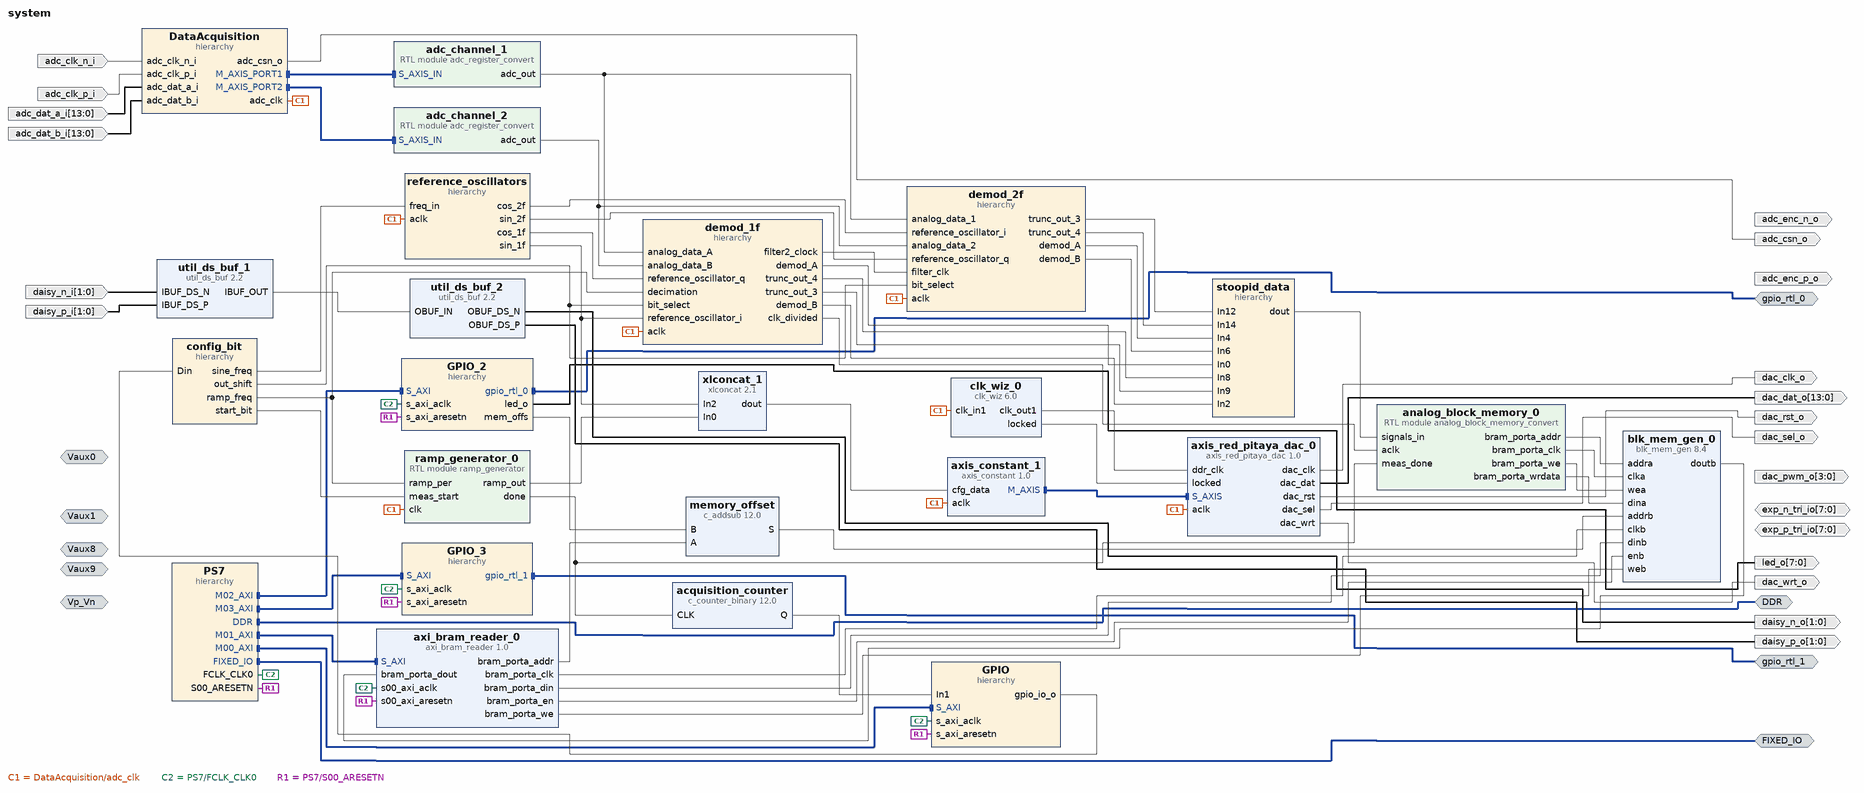
[diagram p0: block diagram of the top level]
# Vivado block design system, xc7z010clg400-1, Vivado 2022.2
create_bd_design system

create_bd_intf_port -mode Slave -vlnv xilinx.com:interface:diff_analog_io_rtl:1.0 Vp_Vn
create_bd_intf_port -mode Slave -vlnv xilinx.com:interface:diff_analog_io_rtl:1.0 Vaux0
create_bd_intf_port -mode Slave -vlnv xilinx.com:interface:diff_analog_io_rtl:1.0 Vaux1
create_bd_intf_port -mode Slave -vlnv xilinx.com:interface:diff_analog_io_rtl:1.0 Vaux9
create_bd_intf_port -mode Slave -vlnv xilinx.com:interface:diff_analog_io_rtl:1.0 Vaux8
create_bd_intf_port -mode Master -vlnv xilinx.com:interface:ddrx_rtl:1.0 DDR
create_bd_intf_port -mode Master -vlnv xilinx.com:display_processing_system7:fixedio_rtl:1.0 FIXED_IO
create_bd_intf_port -mode Master -vlnv xilinx.com:interface:gpio_rtl:1.0 gpio_rtl_0
create_bd_intf_port -mode Master -vlnv xilinx.com:interface:gpio_rtl:1.0 gpio_rtl_1
create_bd_port -dir I -from 13 -to 0 adc_dat_a_i
create_bd_port -dir I -from 13 -to 0 adc_dat_b_i
create_bd_port -dir I adc_clk_p_i
create_bd_port -dir I adc_clk_n_i
create_bd_port -dir O adc_enc_p_o
create_bd_port -dir O adc_enc_n_o
create_bd_port -dir O adc_csn_o
create_bd_port -dir O -from 13 -to 0 dac_dat_o
create_bd_port -dir O dac_clk_o
create_bd_port -dir O dac_rst_o
create_bd_port -dir O dac_sel_o
create_bd_port -dir O dac_wrt_o
create_bd_port -dir O -from 3 -to 0 dac_pwm_o
create_bd_port -dir IO -from 7 -to 0 exp_p_tri_io
create_bd_port -dir IO -from 7 -to 0 exp_n_tri_io
create_bd_port -dir O -from 1 -to 0 daisy_p_o
create_bd_port -dir O -from 1 -to 0 daisy_n_o
create_bd_port -dir I -from 1 -to 0 daisy_p_i
create_bd_port -dir I -from 1 -to 0 daisy_n_i
create_bd_port -dir O -from 7 -to 0 led_o

create_bd_cell -type ip -vlnv xilinx.com:ip:util_ds_buf:2.2 util_ds_buf_1
set_property -dict {CONFIG.C_SIZE 2} [get_bd_cells util_ds_buf_1]
create_bd_cell -type ip -vlnv xilinx.com:ip:util_ds_buf:2.2 util_ds_buf_2
set_property -dict {CONFIG.C_BUF_TYPE OBUFDS CONFIG.C_SIZE 2} [get_bd_cells util_ds_buf_2]
create_bd_cell -type hier GPIO
create_bd_cell -type hier PS7
create_bd_cell -type hier DataAcquisition
create_bd_cell -type ip -vlnv xilinx.com:ip:clk_wiz:6.0 clk_wiz_0
set_property -dict [list \
  CONFIG.CLKIN1_JITTER_PS 80.0 \
  CONFIG.CLKOUT1_JITTER 104.759 \
  CONFIG.CLKOUT1_PHASE_ERROR 96.948 \
  CONFIG.CLKOUT1_REQUESTED_OUT_FREQ 250.000 \
  CONFIG.MMCM_CLKFBOUT_MULT_F 8.000 \
  CONFIG.MMCM_CLKIN1_PERIOD 8.000 \
  CONFIG.MMCM_CLKOUT0_DIVIDE_F 4.000 \
  CONFIG.MMCM_DIVCLK_DIVIDE 1 \
  CONFIG.PRIM_IN_FREQ 125.000 \
  CONFIG.USE_RESET false \
] [get_bd_cells clk_wiz_0]
create_bd_cell -type ip -vlnv pavel-demin:user:axis_red_pitaya_dac:1.0 axis_red_pitaya_dac_0
create_bd_cell -type hier config_bit
create_bd_cell -type ip -vlnv xilinx.com:ip:xlconcat:2.1 xlconcat_1
set_property -dict [list \
  CONFIG.IN0_WIDTH 14 \
  CONFIG.IN1_WIDTH 2 \
  CONFIG.IN2_WIDTH 14 \
  CONFIG.IN3_WIDTH 2 \
  CONFIG.NUM_PORTS 4 \
] [get_bd_cells xlconcat_1]
create_bd_cell -type ip -vlnv pavel-demin:user:axis_constant:1.0 axis_constant_1
create_bd_cell -type ip -vlnv xilinx.com:ip:c_counter_binary:12.0 acquisition_counter
create_bd_cell -type ip -vlnv anton-potocnik:user:axi_bram_reader:1.0 axi_bram_reader_0
set_property -dict {CONFIG.BRAM_ADDR_WIDTH 13} [get_bd_cells axi_bram_reader_0]
create_bd_cell -type ip -vlnv xilinx.com:ip:blk_mem_gen:8.4 blk_mem_gen_0
set_property -dict [list \
  CONFIG.Enable_32bit_Address false \
  CONFIG.Enable_A Always_Enabled \
  CONFIG.Enable_B Use_ENB_Pin \
  CONFIG.Memory_Type True_Dual_Port_RAM \
  CONFIG.Operating_Mode_B READ_FIRST \
  CONFIG.Port_B_Clock 100 \
  CONFIG.Port_B_Enable_Rate 100 \
  CONFIG.Port_B_Write_Rate 50 \
  CONFIG.Read_Width_A 128 \
  CONFIG.Read_Width_B 32 \
  CONFIG.Register_PortA_Output_of_Memory_Primitives false \
  CONFIG.Register_PortB_Output_of_Memory_Primitives false \
  CONFIG.Use_Byte_Write_Enable false \
  CONFIG.Use_RSTA_Pin false \
  CONFIG.Use_RSTB_Pin false \
  CONFIG.Write_Depth_A 16383 \
  CONFIG.Write_Width_A 128 \
  CONFIG.Write_Width_B 32 \
  CONFIG.use_bram_block Stand_Alone \
] [get_bd_cells blk_mem_gen_0]
create_bd_cell -type hier stoopid_data
create_bd_cell -type hier GPIO_2
create_bd_cell -type ip -vlnv xilinx.com:ip:c_addsub:12.0 memory_offset
set_property -dict [list \
  CONFIG.A_Type Signed \
  CONFIG.A_Width 13 \
  CONFIG.B_Constant false \
  CONFIG.B_Type Signed \
  CONFIG.B_Value 0000000000000000 \
  CONFIG.B_Width 16 \
  CONFIG.CE false \
  CONFIG.Implementation Fabric \
  CONFIG.Latency 0 \
  CONFIG.Latency_Configuration Manual \
  CONFIG.Out_Width 16 \
] [get_bd_cells memory_offset]
create_bd_cell -type module -reference analog_block_memory_convert analog_block_memory_0
create_bd_cell -type hier GPIO_3
create_bd_cell -type hier demod_1f
create_bd_cell -type module -reference adc_register_convert adc_channel_1
create_bd_cell -type module -reference adc_register_convert adc_channel_2
create_bd_cell -type hier reference_oscillators
create_bd_cell -type hier demod_2f
create_bd_cell -type module -reference ramp_generator ramp_generator_0

# ---- hierarchy /GPIO ----
current_bd_instance /GPIO
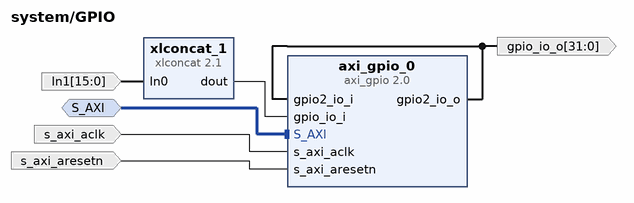
[diagram p1: block diagram inside /GPIO]
create_bd_intf_pin -mode Slave -vlnv xilinx.com:interface:aximm_rtl:1.0 S_AXI
create_bd_pin -dir I -type clk s_axi_aclk
create_bd_pin -dir I -type rst s_axi_aresetn
create_bd_pin -dir O -from 31 -to 0 gpio_io_o
create_bd_pin -dir I -from 15 -to 0 In1

create_bd_cell -type ip -vlnv xilinx.com:ip:xlconcat:2.1 xlconcat_1
set_property -dict {CONFIG.IN0_WIDTH 16 CONFIG.IN1_WIDTH 16} [get_bd_cells xlconcat_1]
create_bd_cell -type ip -vlnv xilinx.com:ip:axi_gpio:2.0 axi_gpio_0
set_property -dict {CONFIG.C_ALL_INPUTS 1 CONFIG.C_ALL_INPUTS_2 0 CONFIG.C_IS_DUAL 1} [get_bd_cells axi_gpio_0]

# ---- hierarchy /PS7 ----
current_bd_instance /PS7
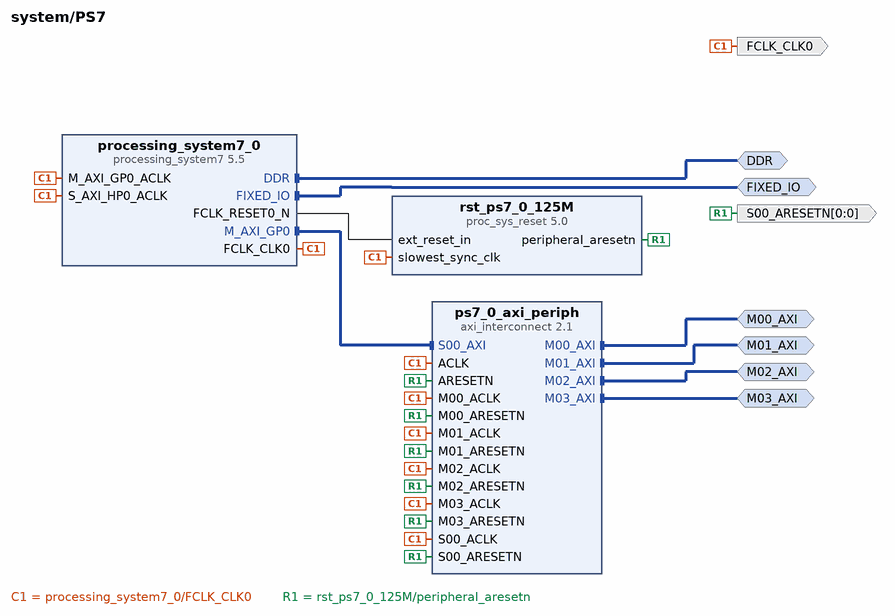
[diagram p2: block diagram inside /PS7]
create_bd_intf_pin -mode Master -vlnv xilinx.com:interface:ddrx_rtl:1.0 DDR
create_bd_intf_pin -mode Master -vlnv xilinx.com:display_processing_system7:fixedio_rtl:1.0 FIXED_IO
create_bd_intf_pin -mode Master -vlnv xilinx.com:interface:aximm_rtl:1.0 M00_AXI
create_bd_intf_pin -mode Master -vlnv xilinx.com:interface:aximm_rtl:1.0 M01_AXI
create_bd_intf_pin -mode Master -vlnv xilinx.com:interface:aximm_rtl:1.0 M02_AXI
create_bd_intf_pin -mode Master -vlnv xilinx.com:interface:aximm_rtl:1.0 M03_AXI
create_bd_pin -dir O -type clk FCLK_CLK0
create_bd_pin -dir O -from 0 -to 0 -type rst S00_ARESETN

create_bd_cell -type ip -vlnv xilinx.com:ip:processing_system7:5.5 processing_system7_0
set_property -dict [list \
  CONFIG.PCW_APU_PERIPHERAL_FREQMHZ 666.666666 \
  CONFIG.PCW_ENET0_ENET0_IO {MIO 16 .. 27} \
  CONFIG.PCW_ENET0_GRP_MDIO_ENABLE 1 \
  CONFIG.PCW_ENET0_GRP_MDIO_IO EMIO \
  CONFIG.PCW_ENET0_PERIPHERAL_ENABLE 1 \
  CONFIG.PCW_ENET0_RESET_ENABLE 0 \
  CONFIG.PCW_ENET_RESET_ENABLE 1 \
  CONFIG.PCW_ENET_RESET_SELECT {Share reset pin} \
  CONFIG.PCW_FPGA0_PERIPHERAL_FREQMHZ 125 \
  CONFIG.PCW_FPGA1_PERIPHERAL_FREQMHZ 250 \
  CONFIG.PCW_FPGA3_PERIPHERAL_FREQMHZ 200 \
  CONFIG.PCW_GPIO_MIO_GPIO_ENABLE 1 \
  CONFIG.PCW_GPIO_MIO_GPIO_IO MIO \
  CONFIG.PCW_GPIO_PERIPHERAL_ENABLE 1 \
  CONFIG.PCW_I2C0_GRP_INT_ENABLE 0 \
  CONFIG.PCW_I2C0_I2C0_IO {MIO 50 .. 51} \
  CONFIG.PCW_I2C0_PERIPHERAL_ENABLE 1 \
  CONFIG.PCW_I2C_PERIPHERAL_FREQMHZ 111.111115 \
  CONFIG.PCW_I2C_RESET_ENABLE 1 \
  CONFIG.PCW_I2C_RESET_SELECT {Share reset pin} \
  CONFIG.PCW_IMPORT_BOARD_PRESET cfg/red_pitaya.xml \
  CONFIG.PCW_PRESET_BANK1_VOLTAGE {LVCMOS 2.5V} \
  CONFIG.PCW_QSPI_GRP_SINGLE_SS_ENABLE 1 \
  CONFIG.PCW_QSPI_GRP_SINGLE_SS_IO {MIO 1 .. 6} \
  CONFIG.PCW_QSPI_PERIPHERAL_ENABLE 1 \
  CONFIG.PCW_QSPI_PERIPHERAL_FREQMHZ 125 \
  CONFIG.PCW_QSPI_QSPI_IO {MIO 1 .. 6} \
  CONFIG.PCW_SD0_GRP_CD_ENABLE 1 \
  CONFIG.PCW_SD0_GRP_CD_IO {MIO 46} \
  CONFIG.PCW_SD0_GRP_WP_ENABLE 1 \
  CONFIG.PCW_SD0_GRP_WP_IO {MIO 47} \
  CONFIG.PCW_SD0_PERIPHERAL_ENABLE 1 \
  CONFIG.PCW_SD0_SD0_IO {MIO 40 .. 45} \
  CONFIG.PCW_SDIO_PERIPHERAL_FREQMHZ 100 \
  CONFIG.PCW_SINGLE_QSPI_DATA_MODE x4 \
  CONFIG.PCW_SPI0_PERIPHERAL_ENABLE 1 \
  CONFIG.PCW_SPI0_SPI0_IO EMIO \
  CONFIG.PCW_SPI1_PERIPHERAL_ENABLE 1 \
  CONFIG.PCW_SPI1_SPI1_IO {MIO 10 .. 15} \
  CONFIG.PCW_TTC0_PERIPHERAL_ENABLE 1 \
  CONFIG.PCW_TTC0_TTC0_IO EMIO \
  CONFIG.PCW_UART0_PERIPHERAL_ENABLE 1 \
  CONFIG.PCW_UART0_UART0_IO {MIO 14 .. 15} \
  CONFIG.PCW_UART1_PERIPHERAL_ENABLE 1 \
  CONFIG.PCW_UART1_UART1_IO {MIO 8 .. 9} \
  CONFIG.PCW_UART_PERIPHERAL_FREQMHZ 100 \
  CONFIG.PCW_UIPARAM_DDR_BUS_WIDTH {16 Bit} \
  CONFIG.PCW_UIPARAM_DDR_FREQ_MHZ 533.333333 \
  CONFIG.PCW_UIPARAM_DDR_PARTNO {MT41J256M16 RE-125} \
  CONFIG.PCW_USB0_PERIPHERAL_ENABLE 1 \
  CONFIG.PCW_USB0_RESET_ENABLE 1 \
  CONFIG.PCW_USB0_RESET_IO {MIO 48} \
  CONFIG.PCW_USB0_USB0_IO {MIO 28 .. 39} \
  CONFIG.PCW_USB_RESET_ENABLE 1 \
  CONFIG.PCW_USB_RESET_SELECT {Share reset pin} \
  CONFIG.PCW_USE_S_AXI_HP0 1 \
] [get_bd_cells processing_system7_0]
# 429 more settings of processing_system7_0 are not shown: defaults, MIO pin electricals, DDR timing, and values the tool derives
create_bd_cell -type ip -vlnv xilinx.com:ip:proc_sys_reset:5.0 rst_ps7_0_125M
create_bd_cell -type ip -vlnv xilinx.com:ip:axi_interconnect:2.1 ps7_0_axi_periph
set_property -dict {CONFIG.NUM_MI 4} [get_bd_cells ps7_0_axi_periph]

# ---- hierarchy /DataAcquisition ----
current_bd_instance /DataAcquisition
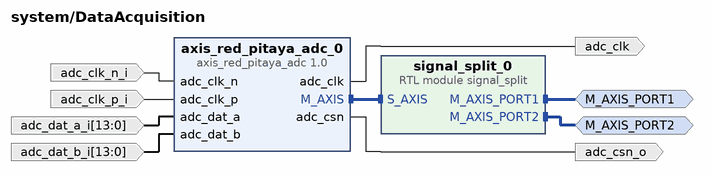
[diagram p3: block diagram inside /DataAcquisition]
create_bd_intf_pin -mode Master -vlnv xilinx.com:interface:axis_rtl:1.0 M_AXIS_PORT1
create_bd_intf_pin -mode Master -vlnv xilinx.com:interface:axis_rtl:1.0 M_AXIS_PORT2
create_bd_pin -dir O -type clk adc_clk
create_bd_pin -dir O adc_csn_o
create_bd_pin -dir I adc_clk_p_i
create_bd_pin -dir I adc_clk_n_i
create_bd_pin -dir I -from 13 -to 0 adc_dat_a_i
create_bd_pin -dir I -from 13 -to 0 adc_dat_b_i

create_bd_cell -type ip -vlnv pavel-demin:user:axis_red_pitaya_adc:1.0 axis_red_pitaya_adc_0
create_bd_cell -type module -reference signal_split signal_split_0

# ---- hierarchy /config_bit ----
current_bd_instance /config_bit
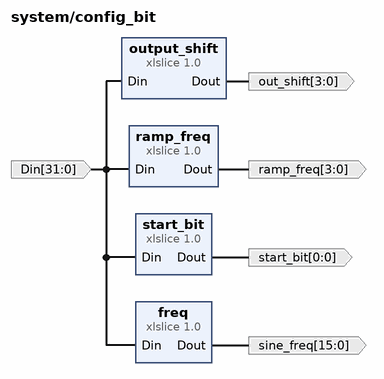
[diagram p4: block diagram inside /config_bit]
create_bd_pin -dir I -from 31 -to 0 Din
create_bd_pin -dir O -from 15 -to 0 sine_freq
create_bd_pin -dir O -from 3 -to 0 ramp_freq
create_bd_pin -dir O -from 0 -to 0 start_bit
create_bd_pin -dir O -from 3 -to 0 out_shift

create_bd_cell -type ip -vlnv xilinx.com:ip:xlslice:1.0 freq
set_property -dict {CONFIG.DIN_FROM 15} [get_bd_cells freq]
create_bd_cell -type ip -vlnv xilinx.com:ip:xlslice:1.0 ramp_freq
set_property -dict {CONFIG.DIN_FROM 19 CONFIG.DIN_TO 16} [get_bd_cells ramp_freq]
create_bd_cell -type ip -vlnv xilinx.com:ip:xlslice:1.0 start_bit
set_property -dict {CONFIG.DIN_FROM 31 CONFIG.DIN_TO 31} [get_bd_cells start_bit]
create_bd_cell -type ip -vlnv xilinx.com:ip:xlslice:1.0 output_shift
set_property -dict {CONFIG.DIN_FROM 23 CONFIG.DIN_TO 20} [get_bd_cells output_shift]

# ---- hierarchy /stoopid_data ----
current_bd_instance /stoopid_data
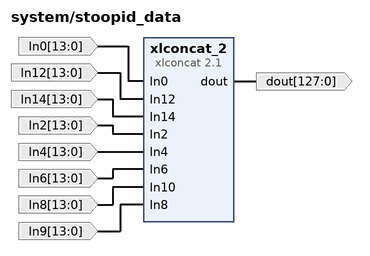
[diagram p5: block diagram inside /stoopid_data]
create_bd_pin -dir O -from 127 -to 0 dout
create_bd_pin -dir I -from 13 -to 0 In0
create_bd_pin -dir I -from 13 -to 0 In2
create_bd_pin -dir I -from 13 -to 0 In4
create_bd_pin -dir I -from 13 -to 0 In6
create_bd_pin -dir I -from 13 -to 0 In8
create_bd_pin -dir I -from 13 -to 0 In14
create_bd_pin -dir I -from 13 -to 0 In9
create_bd_pin -dir I -from 13 -to 0 In12

create_bd_cell -type ip -vlnv xilinx.com:ip:xlconcat:2.1 xlconcat_2
set_property -dict [list \
  CONFIG.IN0_WIDTH 14 \
  CONFIG.IN10_WIDTH 14 \
  CONFIG.IN11_WIDTH 2 \
  CONFIG.IN12_WIDTH 14 \
  CONFIG.IN13_WIDTH 2 \
  CONFIG.IN14_WIDTH 14 \
  CONFIG.IN15_WIDTH 2 \
  CONFIG.IN1_WIDTH 2 \
  CONFIG.IN2_WIDTH 14 \
  CONFIG.IN3_WIDTH 2 \
  CONFIG.IN4_WIDTH 14 \
  CONFIG.IN5_WIDTH 2 \
  CONFIG.IN6_WIDTH 14 \
  CONFIG.IN7_WIDTH 2 \
  CONFIG.IN8_WIDTH 14 \
  CONFIG.IN9_WIDTH 2 \
  CONFIG.NUM_PORTS 16 \
] [get_bd_cells xlconcat_2]

# ---- hierarchy /GPIO_2 ----
current_bd_instance /GPIO_2
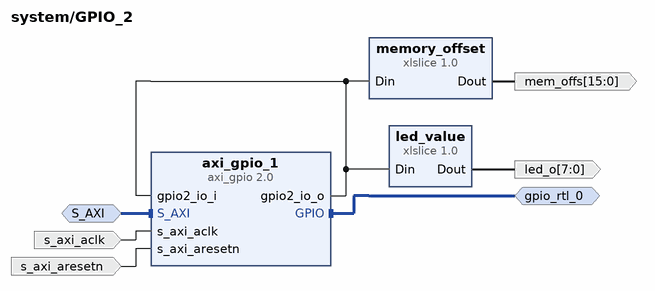
[diagram p6: block diagram inside /GPIO_2]
create_bd_intf_pin -mode Slave -vlnv xilinx.com:interface:aximm_rtl:1.0 S_AXI
create_bd_intf_pin -mode Master -vlnv xilinx.com:interface:gpio_rtl:1.0 gpio_rtl_0
create_bd_pin -dir I -type clk s_axi_aclk
create_bd_pin -dir I -type rst s_axi_aresetn
create_bd_pin -dir O -from 7 -to 0 led_o
create_bd_pin -dir O -from 15 -to 0 mem_offs

create_bd_cell -type ip -vlnv xilinx.com:ip:xlslice:1.0 led_value
set_property -dict {CONFIG.DIN_FROM 7} [get_bd_cells led_value]
create_bd_cell -type ip -vlnv xilinx.com:ip:axi_gpio:2.0 axi_gpio_1
set_property -dict {CONFIG.C_ALL_INPUTS 1 CONFIG.C_ALL_INPUTS_2 0 CONFIG.C_IS_DUAL 1} [get_bd_cells axi_gpio_1]
create_bd_cell -type ip -vlnv xilinx.com:ip:xlslice:1.0 memory_offset
set_property -dict {CONFIG.DIN_FROM 23 CONFIG.DIN_TO 8} [get_bd_cells memory_offset]

# ---- hierarchy /GPIO_3 ----
current_bd_instance /GPIO_3
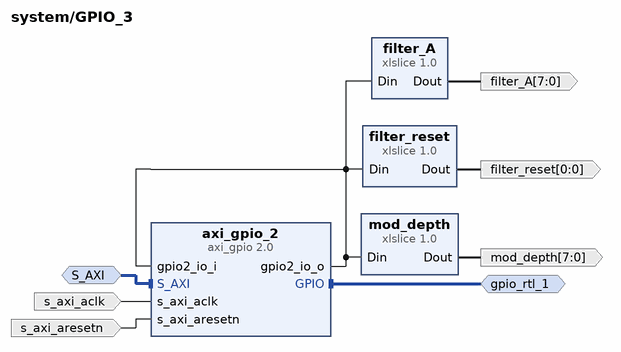
[diagram p7: block diagram inside /GPIO_3]
create_bd_intf_pin -mode Slave -vlnv xilinx.com:interface:aximm_rtl:1.0 S_AXI
create_bd_intf_pin -mode Master -vlnv xilinx.com:interface:gpio_rtl:1.0 gpio_rtl_1
create_bd_pin -dir I -type clk s_axi_aclk
create_bd_pin -dir I -type rst s_axi_aresetn
create_bd_pin -dir O -from 7 -to 0 filter_A
create_bd_pin -dir O -from 7 -to 0 mod_depth
create_bd_pin -dir O -from 0 -to 0 filter_reset

create_bd_cell -type ip -vlnv xilinx.com:ip:xlslice:1.0 filter_A
set_property -dict {CONFIG.DIN_FROM 15 CONFIG.DIN_TO 8} [get_bd_cells filter_A]
create_bd_cell -type ip -vlnv xilinx.com:ip:xlslice:1.0 mod_depth
set_property -dict {CONFIG.DIN_FROM 7} [get_bd_cells mod_depth]
create_bd_cell -type ip -vlnv xilinx.com:ip:axi_gpio:2.0 axi_gpio_2
set_property -dict {CONFIG.C_ALL_INPUTS 1 CONFIG.C_ALL_INPUTS_2 0 CONFIG.C_IS_DUAL 1} [get_bd_cells axi_gpio_2]
create_bd_cell -type ip -vlnv xilinx.com:ip:xlslice:1.0 filter_reset
set_property -dict {CONFIG.DIN_FROM 16 CONFIG.DIN_TO 16} [get_bd_cells filter_reset]

# ---- hierarchy /demod_1f ----
current_bd_instance /demod_1f
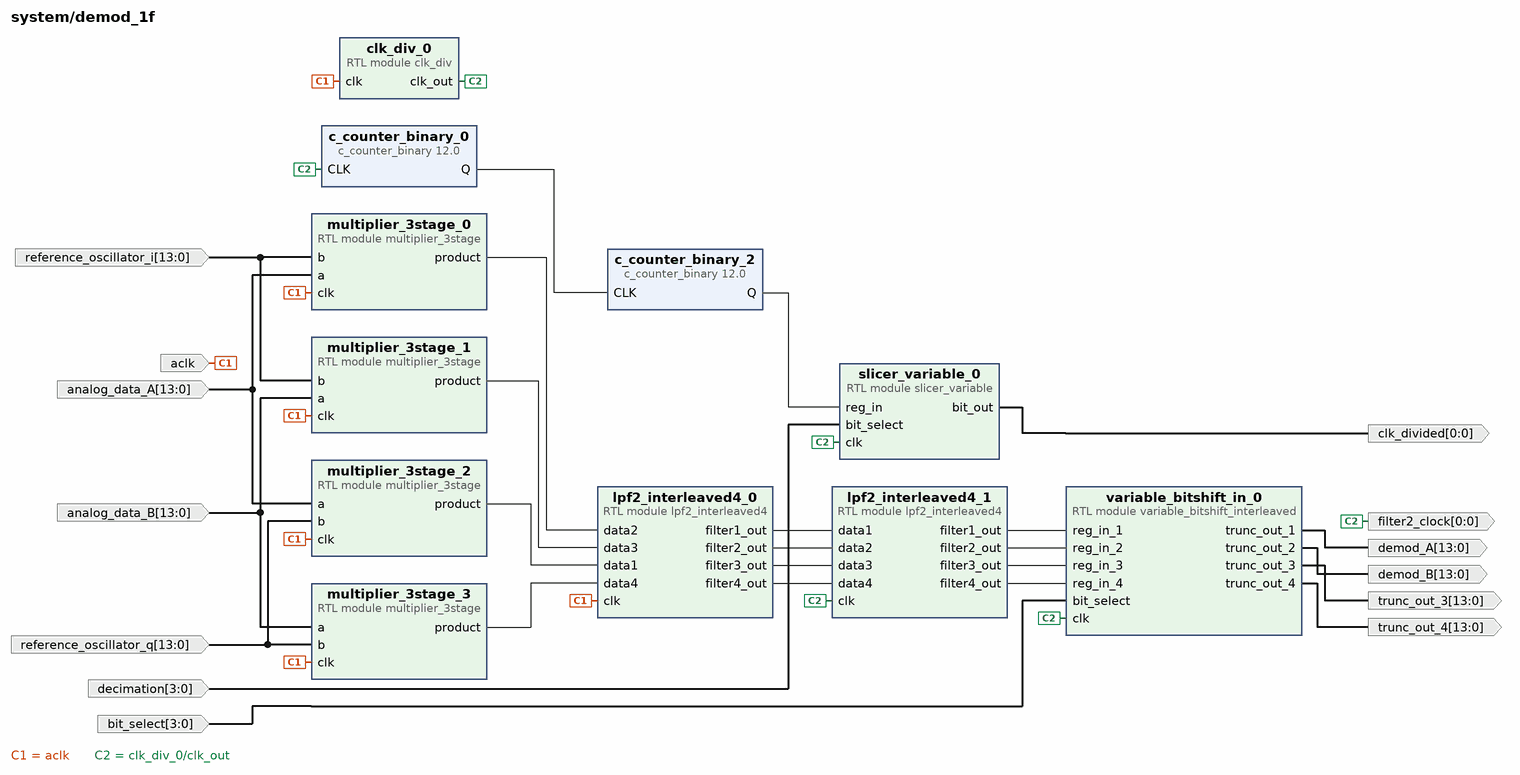
[diagram p8: block diagram inside /demod_1f]
create_bd_pin -dir I -type clk aclk
create_bd_pin -dir O -from 0 -to 0 clk_divided
create_bd_pin -dir O -from 13 -to 0 demod_A
create_bd_pin -dir I -from 3 -to 0 decimation
create_bd_pin -dir I -from 3 -to 0 bit_select
create_bd_pin -dir I -from 13 -to 0 analog_data_A
create_bd_pin -dir I -from 13 -to 0 reference_oscillator_i
create_bd_pin -dir O -from 0 -to 0 -type clk filter2_clock
create_bd_pin -dir I -from 13 -to 0 analog_data_B
create_bd_pin -dir O -from 13 -to 0 demod_B
create_bd_pin -dir I -from 13 -to 0 reference_oscillator_q
create_bd_pin -dir O -from 13 -to 0 trunc_out_3
create_bd_pin -dir O -from 13 -to 0 trunc_out_4

create_bd_cell -type ip -vlnv xilinx.com:ip:c_counter_binary:12.0 c_counter_binary_2
set_property -dict {CONFIG.Output_Width 8} [get_bd_cells c_counter_binary_2]
create_bd_cell -type module -reference slicer_variable slicer_variable_0
create_bd_cell -type module -reference multiplier_3stage multiplier_3stage_0
create_bd_cell -type module -reference multiplier_3stage multiplier_3stage_1
create_bd_cell -type module -reference multiplier_3stage multiplier_3stage_2
create_bd_cell -type module -reference multiplier_3stage multiplier_3stage_3
create_bd_cell -type module -reference variable_bitshift_interleaved variable_bitshift_in_0
create_bd_cell -type module -reference lpf2_interleaved4 lpf2_interleaved4_0
create_bd_cell -type module -reference lpf2_interleaved4 lpf2_interleaved4_1
create_bd_cell -type ip -vlnv xilinx.com:ip:c_counter_binary:12.0 c_counter_binary_0
set_property -dict {CONFIG.Output_Width 1} [get_bd_cells c_counter_binary_0]
create_bd_cell -type module -reference clk_div clk_div_0
set_property -dict {CONFIG.DECIMATION 17} [get_bd_cells clk_div_0]

# ---- hierarchy /reference_oscillators ----
current_bd_instance /reference_oscillators
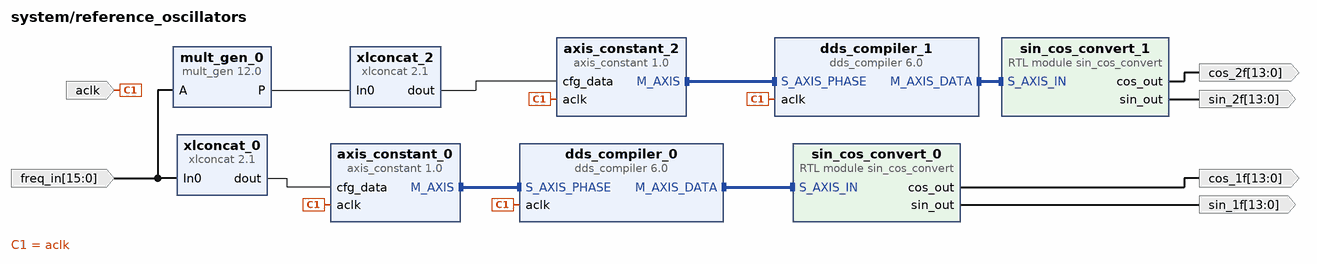
[diagram p9: block diagram inside /reference_oscillators]
create_bd_pin -dir I -from 15 -to 0 freq_in
create_bd_pin -dir I -type clk aclk
create_bd_pin -dir O -from 13 -to 0 sin_1f
create_bd_pin -dir O -from 13 -to 0 cos_1f
create_bd_pin -dir O -from 13 -to 0 cos_2f
create_bd_pin -dir O -from 13 -to 0 sin_2f

create_bd_cell -type ip -vlnv xilinx.com:ip:mult_gen:12.0 mult_gen_0
set_property -dict [list \
  CONFIG.ConstValue 2 \
  CONFIG.MultType Constant_Coefficient_Multiplier \
  CONFIG.OutputWidthHigh 15 \
  CONFIG.PortAType Unsigned \
  CONFIG.PortAWidth 16 \
  CONFIG.Use_Custom_Output_Width true \
] [get_bd_cells mult_gen_0]
create_bd_cell -type ip -vlnv xilinx.com:ip:xlconcat:2.1 xlconcat_0
set_property -dict {CONFIG.IN0_WIDTH 16 CONFIG.IN1_WIDTH 16} [get_bd_cells xlconcat_0]
create_bd_cell -type ip -vlnv pavel-demin:user:axis_constant:1.0 axis_constant_0
create_bd_cell -type ip -vlnv xilinx.com:ip:xlconcat:2.1 xlconcat_2
set_property -dict {CONFIG.IN0_WIDTH 16 CONFIG.IN1_WIDTH 16} [get_bd_cells xlconcat_2]
create_bd_cell -type ip -vlnv pavel-demin:user:axis_constant:1.0 axis_constant_2
create_bd_cell -type module -reference sin_cos_convert sin_cos_convert_0
create_bd_cell -type ip -vlnv xilinx.com:ip:dds_compiler:6.0 dds_compiler_0
set_property -dict [list \
  CONFIG.DATA_Has_TLAST Not_Required \
  CONFIG.DDS_Clock_Rate 125 \
  CONFIG.Frequency_Resolution 0.4 \
  CONFIG.Has_Phase_Out false \
  CONFIG.Latency 9 \
  CONFIG.M_DATA_Has_TUSER Not_Required \
  CONFIG.Noise_Shaping Phase_Dithering \
  CONFIG.Output_Frequency1 0 \
  CONFIG.Output_Width 14 \
  CONFIG.PINC1 0 \
  CONFIG.Parameter_Entry Hardware_Parameters \
  CONFIG.Phase_Increment Streaming \
  CONFIG.Phase_Width 16 \
  CONFIG.Phase_offset Streaming \
  CONFIG.S_PHASE_Has_TUSER Not_Required \
] [get_bd_cells dds_compiler_0]
create_bd_cell -type ip -vlnv xilinx.com:ip:dds_compiler:6.0 dds_compiler_1
set_property -dict [list \
  CONFIG.DATA_Has_TLAST Not_Required \
  CONFIG.DDS_Clock_Rate 125 \
  CONFIG.Frequency_Resolution 0.4 \
  CONFIG.Has_Phase_Out false \
  CONFIG.Latency 9 \
  CONFIG.M_DATA_Has_TUSER Not_Required \
  CONFIG.Noise_Shaping Phase_Dithering \
  CONFIG.Output_Frequency1 0 \
  CONFIG.Output_Width 14 \
  CONFIG.PINC1 0 \
  CONFIG.Parameter_Entry Hardware_Parameters \
  CONFIG.Phase_Increment Streaming \
  CONFIG.Phase_Width 16 \
  CONFIG.Phase_offset Streaming \
  CONFIG.S_PHASE_Has_TUSER Not_Required \
] [get_bd_cells dds_compiler_1]
create_bd_cell -type module -reference sin_cos_convert sin_cos_convert_1

# ---- hierarchy /demod_2f ----
current_bd_instance /demod_2f
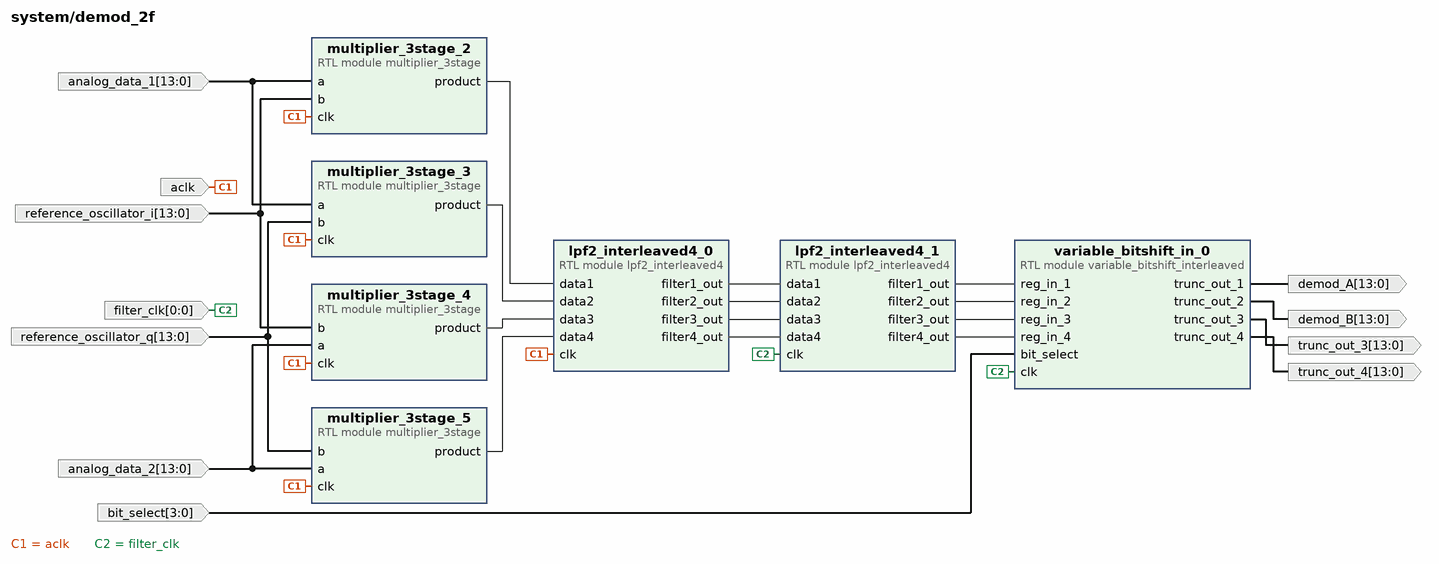
[diagram p10: block diagram inside /demod_2f]
create_bd_pin -dir I -type clk aclk
create_bd_pin -dir O -from 13 -to 0 demod_A
create_bd_pin -dir I -from 3 -to 0 bit_select
create_bd_pin -dir I -from 13 -to 0 analog_data_1
create_bd_pin -dir I -from 13 -to 0 reference_oscillator_i
create_bd_pin -dir I -from 0 -to 0 -type clk filter_clk
create_bd_pin -dir I -from 13 -to 0 analog_data_2
create_bd_pin -dir O -from 13 -to 0 demod_B
create_bd_pin -dir I -from 13 -to 0 reference_oscillator_q
create_bd_pin -dir O -from 13 -to 0 trunc_out_3
create_bd_pin -dir O -from 13 -to 0 trunc_out_4

create_bd_cell -type module -reference multiplier_3stage multiplier_3stage_2
create_bd_cell -type module -reference multiplier_3stage multiplier_3stage_3
create_bd_cell -type module -reference variable_bitshift_interleaved variable_bitshift_in_0
create_bd_cell -type module -reference multiplier_3stage multiplier_3stage_4
create_bd_cell -type module -reference multiplier_3stage multiplier_3stage_5
create_bd_cell -type module -reference lpf2_interleaved4 lpf2_interleaved4_0
create_bd_cell -type module -reference lpf2_interleaved4 lpf2_interleaved4_1

# ---- connections ----

current_bd_instance /GPIO
connect_bd_intf_net [get_bd_intf_pins S_AXI] [get_bd_intf_pins axi_gpio_0/S_AXI]
connect_bd_net -net In1_1 [get_bd_pins In1] [get_bd_pins xlconcat_1/In0]
connect_bd_net [get_bd_pins axi_gpio_0/gpio2_io_o] [get_bd_pins gpio_io_o] [get_bd_pins axi_gpio_0/gpio2_io_i]
connect_bd_net -net processing_system7_0_FCLK_CLK0 [get_bd_pins s_axi_aclk] [get_bd_pins axi_gpio_0/s_axi_aclk]
connect_bd_net -net rst_ps7_0_125M_peripheral_aresetn [get_bd_pins s_axi_aresetn] [get_bd_pins axi_gpio_0/s_axi_aresetn]
connect_bd_net [get_bd_pins xlconcat_1/dout] [get_bd_pins axi_gpio_0/gpio_io_i]

current_bd_instance /PS7
connect_bd_intf_net [get_bd_intf_pins M02_AXI] [get_bd_intf_pins ps7_0_axi_periph/M02_AXI]
connect_bd_intf_net [get_bd_intf_pins M03_AXI] [get_bd_intf_pins ps7_0_axi_periph/M03_AXI]
connect_bd_intf_net [get_bd_intf_pins DDR] [get_bd_intf_pins processing_system7_0/DDR]
connect_bd_intf_net [get_bd_intf_pins FIXED_IO] [get_bd_intf_pins processing_system7_0/FIXED_IO]
connect_bd_intf_net [get_bd_intf_pins processing_system7_0/M_AXI_GP0] [get_bd_intf_pins ps7_0_axi_periph/S00_AXI]
connect_bd_intf_net [get_bd_intf_pins M00_AXI] [get_bd_intf_pins ps7_0_axi_periph/M00_AXI]
connect_bd_intf_net [get_bd_intf_pins M01_AXI] [get_bd_intf_pins ps7_0_axi_periph/M01_AXI]
connect_bd_net [get_bd_pins processing_system7_0/FCLK_CLK0] \
  [get_bd_pins FCLK_CLK0] [get_bd_pins processing_system7_0/S_AXI_HP0_ACLK] [get_bd_pins ps7_0_axi_periph/S00_ACLK] \
  [get_bd_pins rst_ps7_0_125M/slowest_sync_clk] [get_bd_pins ps7_0_axi_periph/M00_ACLK] [get_bd_pins ps7_0_axi_periph/ACLK] \
  [get_bd_pins ps7_0_axi_periph/M01_ACLK] [get_bd_pins processing_system7_0/M_AXI_GP0_ACLK] \
  [get_bd_pins ps7_0_axi_periph/M02_ACLK] [get_bd_pins ps7_0_axi_periph/M03_ACLK]
connect_bd_net [get_bd_pins processing_system7_0/FCLK_RESET0_N] [get_bd_pins rst_ps7_0_125M/ext_reset_in]
connect_bd_net [get_bd_pins rst_ps7_0_125M/peripheral_aresetn] \
  [get_bd_pins S00_ARESETN] [get_bd_pins ps7_0_axi_periph/S00_ARESETN] [get_bd_pins ps7_0_axi_periph/M00_ARESETN] \
  [get_bd_pins ps7_0_axi_periph/ARESETN] [get_bd_pins ps7_0_axi_periph/M01_ARESETN] \
  [get_bd_pins ps7_0_axi_periph/M02_ARESETN] [get_bd_pins ps7_0_axi_periph/M03_ARESETN]

current_bd_instance /DataAcquisition
connect_bd_intf_net [get_bd_intf_pins M_AXIS_PORT2] [get_bd_intf_pins signal_split_0/M_AXIS_PORT2]
connect_bd_intf_net [get_bd_intf_pins signal_split_0/S_AXIS] [get_bd_intf_pins axis_red_pitaya_adc_0/M_AXIS]
connect_bd_intf_net [get_bd_intf_pins M_AXIS_PORT1] [get_bd_intf_pins signal_split_0/M_AXIS_PORT1]
connect_bd_net [get_bd_pins adc_clk_n_i] [get_bd_pins axis_red_pitaya_adc_0/adc_clk_n]
connect_bd_net [get_bd_pins adc_clk_p_i] [get_bd_pins axis_red_pitaya_adc_0/adc_clk_p]
connect_bd_net [get_bd_pins adc_dat_a_i] [get_bd_pins axis_red_pitaya_adc_0/adc_dat_a]
connect_bd_net [get_bd_pins adc_dat_b_i] [get_bd_pins axis_red_pitaya_adc_0/adc_dat_b]
connect_bd_net [get_bd_pins axis_red_pitaya_adc_0/adc_clk] [get_bd_pins adc_clk]
connect_bd_net [get_bd_pins axis_red_pitaya_adc_0/adc_csn] [get_bd_pins adc_csn_o]

current_bd_instance /config_bit
connect_bd_net -net GPIO_gpio_io_o [get_bd_pins Din] \
  [get_bd_pins ramp_freq/Din] [get_bd_pins freq/Din] [get_bd_pins start_bit/Din] [get_bd_pins output_shift/Din]
connect_bd_net [get_bd_pins freq/Dout] [get_bd_pins sine_freq]
connect_bd_net [get_bd_pins output_shift/Dout] [get_bd_pins out_shift]
connect_bd_net [get_bd_pins ramp_freq/Dout] [get_bd_pins ramp_freq]
connect_bd_net [get_bd_pins start_bit/Dout] [get_bd_pins start_bit]

current_bd_instance /stoopid_data
connect_bd_net -net In0_1 [get_bd_pins In0] [get_bd_pins xlconcat_2/In0]
connect_bd_net -net In12_1 [get_bd_pins In12] [get_bd_pins xlconcat_2/In12]
connect_bd_net -net In14_1 [get_bd_pins In14] [get_bd_pins xlconcat_2/In14]
connect_bd_net -net In2_1 [get_bd_pins In2] [get_bd_pins xlconcat_2/In2]
connect_bd_net -net In4_1 [get_bd_pins In4] [get_bd_pins xlconcat_2/In4]
connect_bd_net -net In6_1 [get_bd_pins In6] [get_bd_pins xlconcat_2/In6]
connect_bd_net -net In8_1 [get_bd_pins In8] [get_bd_pins xlconcat_2/In10]
connect_bd_net -net In9_1 [get_bd_pins In9] [get_bd_pins xlconcat_2/In8]
connect_bd_net [get_bd_pins xlconcat_2/dout] [get_bd_pins dout]

current_bd_instance /GPIO_2
connect_bd_intf_net [get_bd_intf_pins gpio_rtl_0] [get_bd_intf_pins axi_gpio_1/GPIO]
connect_bd_intf_net -intf_net PS7_M02_AXI [get_bd_intf_pins S_AXI] [get_bd_intf_pins axi_gpio_1/S_AXI]
connect_bd_net [get_bd_pins axi_gpio_1/gpio2_io_o] [get_bd_pins led_value/Din] [get_bd_pins axi_gpio_1/gpio2_io_i] [get_bd_pins memory_offset/Din]
connect_bd_net [get_bd_pins memory_offset/Dout] [get_bd_pins mem_offs]
connect_bd_net -net processing_system7_0_FCLK_CLK0 [get_bd_pins s_axi_aclk] [get_bd_pins axi_gpio_1/s_axi_aclk]
connect_bd_net -net rst_ps7_0_125M_peripheral_aresetn [get_bd_pins s_axi_aresetn] [get_bd_pins axi_gpio_1/s_axi_aresetn]
connect_bd_net -net xlslice_0_Dout [get_bd_pins led_value/Dout] [get_bd_pins led_o]

current_bd_instance /GPIO_3
connect_bd_intf_net [get_bd_intf_pins gpio_rtl_1] [get_bd_intf_pins axi_gpio_2/GPIO]
connect_bd_intf_net -intf_net PS7_M03_AXI [get_bd_intf_pins S_AXI] [get_bd_intf_pins axi_gpio_2/S_AXI]
connect_bd_net [get_bd_pins axi_gpio_2/gpio2_io_o] \
  [get_bd_pins mod_depth/Din] [get_bd_pins axi_gpio_2/gpio2_io_i] [get_bd_pins filter_A/Din] [get_bd_pins filter_reset/Din]
connect_bd_net [get_bd_pins filter_A/Dout] [get_bd_pins filter_A]
connect_bd_net -net filter_B_Dout [get_bd_pins mod_depth/Dout] [get_bd_pins mod_depth]
connect_bd_net [get_bd_pins filter_reset/Dout] [get_bd_pins filter_reset]
connect_bd_net -net processing_system7_0_FCLK_CLK0 [get_bd_pins s_axi_aclk] [get_bd_pins axi_gpio_2/s_axi_aclk]
connect_bd_net -net rst_ps7_0_125M_peripheral_aresetn [get_bd_pins s_axi_aresetn] [get_bd_pins axi_gpio_2/s_axi_aresetn]

current_bd_instance /demod_1f
connect_bd_net -net Op2_1 [get_bd_pins decimation] [get_bd_pins slicer_variable_0/bit_select]
connect_bd_net [get_bd_pins aclk] \
  [get_bd_pins multiplier_3stage_0/clk] [get_bd_pins multiplier_3stage_1/clk] [get_bd_pins multiplier_3stage_2/clk] \
  [get_bd_pins multiplier_3stage_3/clk] [get_bd_pins lpf2_interleaved4_0/clk] [get_bd_pins clk_div_0/clk]
connect_bd_net [get_bd_pins analog_data_A] [get_bd_pins multiplier_3stage_0/a] [get_bd_pins multiplier_3stage_2/a]
connect_bd_net [get_bd_pins analog_data_B] [get_bd_pins multiplier_3stage_1/a] [get_bd_pins multiplier_3stage_3/a]
connect_bd_net -net b_1 [get_bd_pins reference_oscillator_q] [get_bd_pins multiplier_3stage_2/b] [get_bd_pins multiplier_3stage_3/b]
connect_bd_net [get_bd_pins bit_select] [get_bd_pins variable_bitshift_in_0/bit_select]
connect_bd_net [get_bd_pins c_counter_binary_0/Q] [get_bd_pins c_counter_binary_2/CLK]
connect_bd_net [get_bd_pins c_counter_binary_2/Q] [get_bd_pins slicer_variable_0/reg_in]
connect_bd_net [get_bd_pins lpf2_interleaved4_0/filter1_out] [get_bd_pins lpf2_interleaved4_1/data1]
connect_bd_net [get_bd_pins lpf2_interleaved4_0/filter2_out] [get_bd_pins lpf2_interleaved4_1/data2]
connect_bd_net [get_bd_pins lpf2_interleaved4_0/filter3_out] [get_bd_pins lpf2_interleaved4_1/data3]
connect_bd_net [get_bd_pins lpf2_interleaved4_0/filter4_out] [get_bd_pins lpf2_interleaved4_1/data4]
connect_bd_net [get_bd_pins lpf2_interleaved4_1/filter1_out] [get_bd_pins variable_bitshift_in_0/reg_in_1]
connect_bd_net [get_bd_pins lpf2_interleaved4_1/filter2_out] [get_bd_pins variable_bitshift_in_0/reg_in_2]
connect_bd_net [get_bd_pins lpf2_interleaved4_1/filter3_out] [get_bd_pins variable_bitshift_in_0/reg_in_3]
connect_bd_net [get_bd_pins lpf2_interleaved4_1/filter4_out] [get_bd_pins variable_bitshift_in_0/reg_in_4]
connect_bd_net [get_bd_pins multiplier_3stage_0/product] [get_bd_pins lpf2_interleaved4_0/data2]
connect_bd_net [get_bd_pins multiplier_3stage_1/product] [get_bd_pins lpf2_interleaved4_0/data3]
connect_bd_net [get_bd_pins multiplier_3stage_2/product] [get_bd_pins lpf2_interleaved4_0/data1]
connect_bd_net [get_bd_pins multiplier_3stage_3/product] [get_bd_pins lpf2_interleaved4_0/data4]
connect_bd_net -net reference_oscillator_1 [get_bd_pins reference_oscillator_i] \
  [get_bd_pins multiplier_3stage_0/b] [get_bd_pins multiplier_3stage_1/b]
connect_bd_net [get_bd_pins slicer_variable_0/bit_out] [get_bd_pins clk_divided]
connect_bd_net [get_bd_pins variable_bitshift_in_0/trunc_out_1] [get_bd_pins demod_A]
connect_bd_net [get_bd_pins variable_bitshift_in_0/trunc_out_2] [get_bd_pins demod_B]
connect_bd_net [get_bd_pins variable_bitshift_in_0/trunc_out_3] [get_bd_pins trunc_out_3]
connect_bd_net [get_bd_pins variable_bitshift_in_0/trunc_out_4] [get_bd_pins trunc_out_4]
connect_bd_net -net xlslice_1_Dout [get_bd_pins clk_div_0/clk_out] \
  [get_bd_pins filter2_clock] [get_bd_pins lpf2_interleaved4_1/clk] [get_bd_pins c_counter_binary_0/CLK] \
  [get_bd_pins slicer_variable_0/clk] [get_bd_pins variable_bitshift_in_0/clk]

current_bd_instance /reference_oscillators
connect_bd_intf_net [get_bd_intf_pins axis_constant_0/M_AXIS] [get_bd_intf_pins dds_compiler_0/S_AXIS_PHASE]
connect_bd_intf_net [get_bd_intf_pins axis_constant_2/M_AXIS] [get_bd_intf_pins dds_compiler_1/S_AXIS_PHASE]
connect_bd_intf_net [get_bd_intf_pins sin_cos_convert_0/S_AXIS_IN] [get_bd_intf_pins dds_compiler_0/M_AXIS_DATA]
connect_bd_intf_net [get_bd_intf_pins sin_cos_convert_1/S_AXIS_IN] [get_bd_intf_pins dds_compiler_1/M_AXIS_DATA]
connect_bd_net -net axis_red_pitaya_adc_0_adc_clk [get_bd_pins aclk] \
  [get_bd_pins dds_compiler_0/aclk] [get_bd_pins dds_compiler_1/aclk] [get_bd_pins axis_constant_2/aclk] \
  [get_bd_pins axis_constant_0/aclk]
connect_bd_net -net config_bit_Dout [get_bd_pins freq_in] [get_bd_pins xlconcat_0/In0] [get_bd_pins mult_gen_0/A]
connect_bd_net [get_bd_pins mult_gen_0/P] [get_bd_pins xlconcat_2/In0]
connect_bd_net [get_bd_pins sin_cos_convert_0/cos_out] [get_bd_pins cos_1f]
connect_bd_net [get_bd_pins sin_cos_convert_0/sin_out] [get_bd_pins sin_1f]
connect_bd_net [get_bd_pins sin_cos_convert_1/cos_out] [get_bd_pins cos_2f]
connect_bd_net [get_bd_pins sin_cos_convert_1/sin_out] [get_bd_pins sin_2f]
connect_bd_net [get_bd_pins xlconcat_0/dout] [get_bd_pins axis_constant_0/cfg_data]
connect_bd_net [get_bd_pins xlconcat_2/dout] [get_bd_pins axis_constant_2/cfg_data]

current_bd_instance /demod_2f
connect_bd_net [get_bd_pins aclk] \
  [get_bd_pins multiplier_3stage_2/clk] [get_bd_pins multiplier_3stage_3/clk] [get_bd_pins multiplier_3stage_4/clk] \
  [get_bd_pins multiplier_3stage_5/clk] [get_bd_pins lpf2_interleaved4_0/clk]
connect_bd_net -net analog_data_1_1 [get_bd_pins analog_data_1] [get_bd_pins multiplier_3stage_2/a] [get_bd_pins multiplier_3stage_3/a]
connect_bd_net -net analog_data_2_1 [get_bd_pins analog_data_2] [get_bd_pins multiplier_3stage_4/a] [get_bd_pins multiplier_3stage_5/a]
connect_bd_net [get_bd_pins bit_select] [get_bd_pins variable_bitshift_in_0/bit_select]
connect_bd_net [get_bd_pins filter_clk] [get_bd_pins lpf2_interleaved4_1/clk] [get_bd_pins variable_bitshift_in_0/clk]
connect_bd_net [get_bd_pins lpf2_interleaved4_0/filter1_out] [get_bd_pins lpf2_interleaved4_1/data1]
connect_bd_net [get_bd_pins lpf2_interleaved4_0/filter2_out] [get_bd_pins lpf2_interleaved4_1/data2]
connect_bd_net [get_bd_pins lpf2_interleaved4_0/filter3_out] [get_bd_pins lpf2_interleaved4_1/data3]
connect_bd_net [get_bd_pins lpf2_interleaved4_0/filter4_out] [get_bd_pins lpf2_interleaved4_1/data4]
connect_bd_net [get_bd_pins lpf2_interleaved4_1/filter1_out] [get_bd_pins variable_bitshift_in_0/reg_in_1]
connect_bd_net [get_bd_pins lpf2_interleaved4_1/filter2_out] [get_bd_pins variable_bitshift_in_0/reg_in_2]
connect_bd_net [get_bd_pins lpf2_interleaved4_1/filter3_out] [get_bd_pins variable_bitshift_in_0/reg_in_3]
connect_bd_net [get_bd_pins lpf2_interleaved4_1/filter4_out] [get_bd_pins variable_bitshift_in_0/reg_in_4]
connect_bd_net [get_bd_pins multiplier_3stage_2/product] [get_bd_pins lpf2_interleaved4_0/data1]
connect_bd_net [get_bd_pins multiplier_3stage_3/product] [get_bd_pins lpf2_interleaved4_0/data2]
connect_bd_net [get_bd_pins multiplier_3stage_4/product] [get_bd_pins lpf2_interleaved4_0/data3]
connect_bd_net [get_bd_pins multiplier_3stage_5/product] [get_bd_pins lpf2_interleaved4_0/data4]
connect_bd_net [get_bd_pins reference_oscillator_i] [get_bd_pins multiplier_3stage_2/b] [get_bd_pins multiplier_3stage_4/b]
connect_bd_net [get_bd_pins reference_oscillator_q] [get_bd_pins multiplier_3stage_5/b] [get_bd_pins multiplier_3stage_3/b]
connect_bd_net [get_bd_pins variable_bitshift_in_0/trunc_out_1] [get_bd_pins demod_A]
connect_bd_net [get_bd_pins variable_bitshift_in_0/trunc_out_2] [get_bd_pins demod_B]
connect_bd_net [get_bd_pins variable_bitshift_in_0/trunc_out_3] [get_bd_pins trunc_out_3]
connect_bd_net [get_bd_pins variable_bitshift_in_0/trunc_out_4] [get_bd_pins trunc_out_4]

current_bd_instance /
connect_bd_intf_net [get_bd_intf_pins adc_channel_1/S_AXIS_IN] [get_bd_intf_pins DataAcquisition/M_AXIS_PORT1]
connect_bd_intf_net [get_bd_intf_pins adc_channel_2/S_AXIS_IN] [get_bd_intf_pins DataAcquisition/M_AXIS_PORT2]
connect_bd_intf_net [get_bd_intf_ports gpio_rtl_0] [get_bd_intf_pins GPIO_2/gpio_rtl_0]
connect_bd_intf_net [get_bd_intf_ports gpio_rtl_1] [get_bd_intf_pins GPIO_3/gpio_rtl_1]
connect_bd_intf_net [get_bd_intf_pins PS7/M01_AXI] [get_bd_intf_pins axi_bram_reader_0/S_AXI]
connect_bd_intf_net [get_bd_intf_pins GPIO_2/S_AXI] [get_bd_intf_pins PS7/M02_AXI]
connect_bd_intf_net [get_bd_intf_pins GPIO_3/S_AXI] [get_bd_intf_pins PS7/M03_AXI]
connect_bd_intf_net [get_bd_intf_pins axis_constant_1/M_AXIS] [get_bd_intf_pins axis_red_pitaya_dac_0/S_AXIS]
connect_bd_intf_net -intf_net processing_system7_0_DDR [get_bd_intf_ports DDR] [get_bd_intf_pins PS7/DDR]
connect_bd_intf_net -intf_net processing_system7_0_FIXED_IO [get_bd_intf_ports FIXED_IO] [get_bd_intf_pins PS7/FIXED_IO]
connect_bd_intf_net [get_bd_intf_pins PS7/M00_AXI] [get_bd_intf_pins GPIO/S_AXI]
connect_bd_net -net GPIO_2_Dout [get_bd_pins GPIO_2/mem_offs] [get_bd_pins memory_offset/B]
connect_bd_net [get_bd_pins GPIO_2/led_o] [get_bd_ports led_o]
connect_bd_net [get_bd_pins GPIO/gpio_io_o] [get_bd_pins config_bit/Din]
connect_bd_net -net In0_1 [get_bd_pins demod_1f/demod_A] [get_bd_pins stoopid_data/In0]
connect_bd_net -net In12_1 [get_bd_pins demod_2f/trunc_out_3] [get_bd_pins stoopid_data/In12]
connect_bd_net -net In14_1 [get_bd_pins demod_2f/trunc_out_4] [get_bd_pins stoopid_data/In14]
connect_bd_net -net In8_1 [get_bd_pins demod_1f/trunc_out_4] [get_bd_pins stoopid_data/In8]
connect_bd_net -net In9_1 [get_bd_pins demod_1f/trunc_out_3] [get_bd_pins stoopid_data/In9]
connect_bd_net [get_bd_pins adc_channel_2/adc_out] [get_bd_pins demod_1f/analog_data_B] [get_bd_pins demod_2f/analog_data_2]
connect_bd_net [get_bd_ports adc_clk_n_i] [get_bd_pins DataAcquisition/adc_clk_n_i]
connect_bd_net [get_bd_ports adc_clk_p_i] [get_bd_pins DataAcquisition/adc_clk_p_i]
connect_bd_net [get_bd_ports adc_dat_a_i] [get_bd_pins DataAcquisition/adc_dat_a_i]
connect_bd_net [get_bd_ports adc_dat_b_i] [get_bd_pins DataAcquisition/adc_dat_b_i]
connect_bd_net -net adc_register_convert_0_adc_out [get_bd_pins adc_channel_1/adc_out] \
  [get_bd_pins demod_1f/analog_data_A] [get_bd_pins demod_2f/analog_data_1]
connect_bd_net [get_bd_pins analog_block_memory_0/bram_porta_addr] [get_bd_pins blk_mem_gen_0/addra]
connect_bd_net [get_bd_pins analog_block_memory_0/bram_porta_clk] [get_bd_pins blk_mem_gen_0/clka]
connect_bd_net [get_bd_pins analog_block_memory_0/bram_porta_we] [get_bd_pins blk_mem_gen_0/wea]
connect_bd_net [get_bd_pins analog_block_memory_0/bram_porta_wrdata] [get_bd_pins blk_mem_gen_0/dina]
connect_bd_net [get_bd_pins axi_bram_reader_0/bram_porta_addr] [get_bd_pins memory_offset/A]
connect_bd_net [get_bd_pins axi_bram_reader_0/bram_porta_clk] [get_bd_pins blk_mem_gen_0/clkb]
connect_bd_net [get_bd_pins axi_bram_reader_0/bram_porta_din] [get_bd_pins blk_mem_gen_0/dinb]
connect_bd_net [get_bd_pins axi_bram_reader_0/bram_porta_en] [get_bd_pins blk_mem_gen_0/enb]
connect_bd_net [get_bd_pins axi_bram_reader_0/bram_porta_we] [get_bd_pins blk_mem_gen_0/web]
connect_bd_net -net axis_red_pitaya_adc_0_adc_clk [get_bd_pins DataAcquisition/adc_clk] \
  [get_bd_pins axis_red_pitaya_dac_0/aclk] [get_bd_pins clk_wiz_0/clk_in1] [get_bd_pins axis_constant_1/aclk] \
  [get_bd_pins demod_1f/aclk] [get_bd_pins reference_oscillators/aclk] [get_bd_pins demod_2f/aclk] \
  [get_bd_pins ramp_generator_0/clk]
connect_bd_net -net axis_red_pitaya_adc_0_adc_csn [get_bd_pins DataAcquisition/adc_csn_o] [get_bd_ports adc_csn_o]
connect_bd_net [get_bd_pins axis_red_pitaya_dac_0/dac_clk] [get_bd_ports dac_clk_o]
connect_bd_net [get_bd_pins axis_red_pitaya_dac_0/dac_dat] [get_bd_ports dac_dat_o]
connect_bd_net [get_bd_pins axis_red_pitaya_dac_0/dac_rst] [get_bd_ports dac_rst_o]
connect_bd_net [get_bd_pins axis_red_pitaya_dac_0/dac_sel] [get_bd_ports dac_sel_o]
connect_bd_net [get_bd_pins axis_red_pitaya_dac_0/dac_wrt] [get_bd_ports dac_wrt_o]
connect_bd_net -net bit_select_1 [get_bd_pins config_bit/out_shift] [get_bd_pins demod_1f/bit_select] [get_bd_pins demod_2f/bit_select]
connect_bd_net [get_bd_pins blk_mem_gen_0/doutb] [get_bd_pins axi_bram_reader_0/bram_porta_dout]
connect_bd_net -net c_addsub_0_S [get_bd_pins memory_offset/S] [get_bd_pins blk_mem_gen_0/addrb]
connect_bd_net -net c_counter_binary_0_Q [get_bd_pins acquisition_counter/Q] [get_bd_pins GPIO/In1]
connect_bd_net [get_bd_pins clk_wiz_0/clk_out1] [get_bd_pins axis_red_pitaya_dac_0/ddr_clk]
connect_bd_net [get_bd_pins clk_wiz_0/locked] [get_bd_pins axis_red_pitaya_dac_0/locked]
connect_bd_net -net config_bit_Dout [get_bd_pins config_bit/sine_freq] [get_bd_pins reference_oscillators/freq_in]
connect_bd_net [get_bd_pins config_bit/ramp_freq] [get_bd_pins demod_1f/decimation] [get_bd_pins ramp_generator_0/ramp_per]
connect_bd_net [get_bd_pins config_bit/start_bit] [get_bd_pins ramp_generator_0/meas_start]
connect_bd_net [get_bd_ports daisy_n_i] [get_bd_pins util_ds_buf_1/IBUF_DS_N]
connect_bd_net [get_bd_ports daisy_p_i] [get_bd_pins util_ds_buf_1/IBUF_DS_P]
connect_bd_net [get_bd_pins demod_1f/demod_B] [get_bd_pins stoopid_data/In2]
connect_bd_net -net demod_1f_i_Dout [get_bd_pins demod_1f/filter2_clock] [get_bd_pins demod_2f/filter_clk]
connect_bd_net -net demod_1f_i_clk_divided [get_bd_pins demod_1f/clk_divided] [get_bd_pins analog_block_memory_0/aclk]
connect_bd_net -net demod_2f_i_demod_A [get_bd_pins demod_2f/demod_A] [get_bd_pins stoopid_data/In4]
connect_bd_net -net demod_2f_i_demod_B [get_bd_pins demod_2f/demod_B] [get_bd_pins stoopid_data/In6]
connect_bd_net -net processing_system7_0_FCLK_CLK0 [get_bd_pins PS7/FCLK_CLK0] \
  [get_bd_pins GPIO/s_axi_aclk] [get_bd_pins axi_bram_reader_0/s00_axi_aclk] [get_bd_pins GPIO_2/s_axi_aclk] \
  [get_bd_pins GPIO_3/s_axi_aclk]
connect_bd_net [get_bd_pins ramp_generator_0/done] [get_bd_pins acquisition_counter/CLK] [get_bd_pins analog_block_memory_0/meas_done]
connect_bd_net [get_bd_pins ramp_generator_0/ramp_out] [get_bd_pins xlconcat_1/In0]
connect_bd_net -net reference_oscillator_i_1 [get_bd_pins reference_oscillators/cos_2f] [get_bd_pins demod_2f/reference_oscillator_i]
connect_bd_net [get_bd_pins reference_oscillators/cos_1f] [get_bd_pins demod_1f/reference_oscillator_q]
connect_bd_net [get_bd_pins reference_oscillators/sin_2f] [get_bd_pins demod_2f/reference_oscillator_q]
connect_bd_net -net rst_ps7_0_125M_peripheral_aresetn [get_bd_pins PS7/S00_ARESETN] \
  [get_bd_pins GPIO/s_axi_aresetn] [get_bd_pins axi_bram_reader_0/s00_axi_aresetn] [get_bd_pins GPIO_2/s_axi_aresetn] \
  [get_bd_pins GPIO_3/s_axi_aresetn]
connect_bd_net -net sin_cos_convert_0_sin_out [get_bd_pins reference_oscillators/sin_1f] \
  [get_bd_pins demod_1f/reference_oscillator_i] [get_bd_pins xlconcat_1/In2]
connect_bd_net [get_bd_pins stoopid_data/dout] [get_bd_pins analog_block_memory_0/signals_in]
connect_bd_net [get_bd_pins util_ds_buf_1/IBUF_OUT] [get_bd_pins util_ds_buf_2/OBUF_IN]
connect_bd_net [get_bd_pins util_ds_buf_2/OBUF_DS_N] [get_bd_ports daisy_n_o]
connect_bd_net [get_bd_pins util_ds_buf_2/OBUF_DS_P] [get_bd_ports daisy_p_o]
connect_bd_net [get_bd_pins xlconcat_1/dout] [get_bd_pins axis_constant_1/cfg_data]

# ---- address map ----
assign_bd_address -offset 0x40000000 -range 32K -target_address_space [get_bd_addr_spaces PS7/processing_system7_0/Data] [get_bd_addr_segs axi_bram_reader_0/s00_axi/reg0]
assign_bd_address -offset 0x41000000 -range 4K -target_address_space [get_bd_addr_spaces PS7/processing_system7_0/Data] [get_bd_addr_segs GPIO_2/axi_gpio_1/S_AXI/Reg]
assign_bd_address -offset 0x41200000 -range 4K -target_address_space [get_bd_addr_spaces PS7/processing_system7_0/Data] [get_bd_addr_segs GPIO_3/axi_gpio_2/S_AXI/Reg]
assign_bd_address -offset 0x42000000 -range 4K -target_address_space [get_bd_addr_spaces PS7/processing_system7_0/Data] [get_bd_addr_segs GPIO/axi_gpio_0/S_AXI/Reg]

validate_bd_design
save_bd_design
